# EasyEDA Pro project FOC_drive.epro, board PCB15
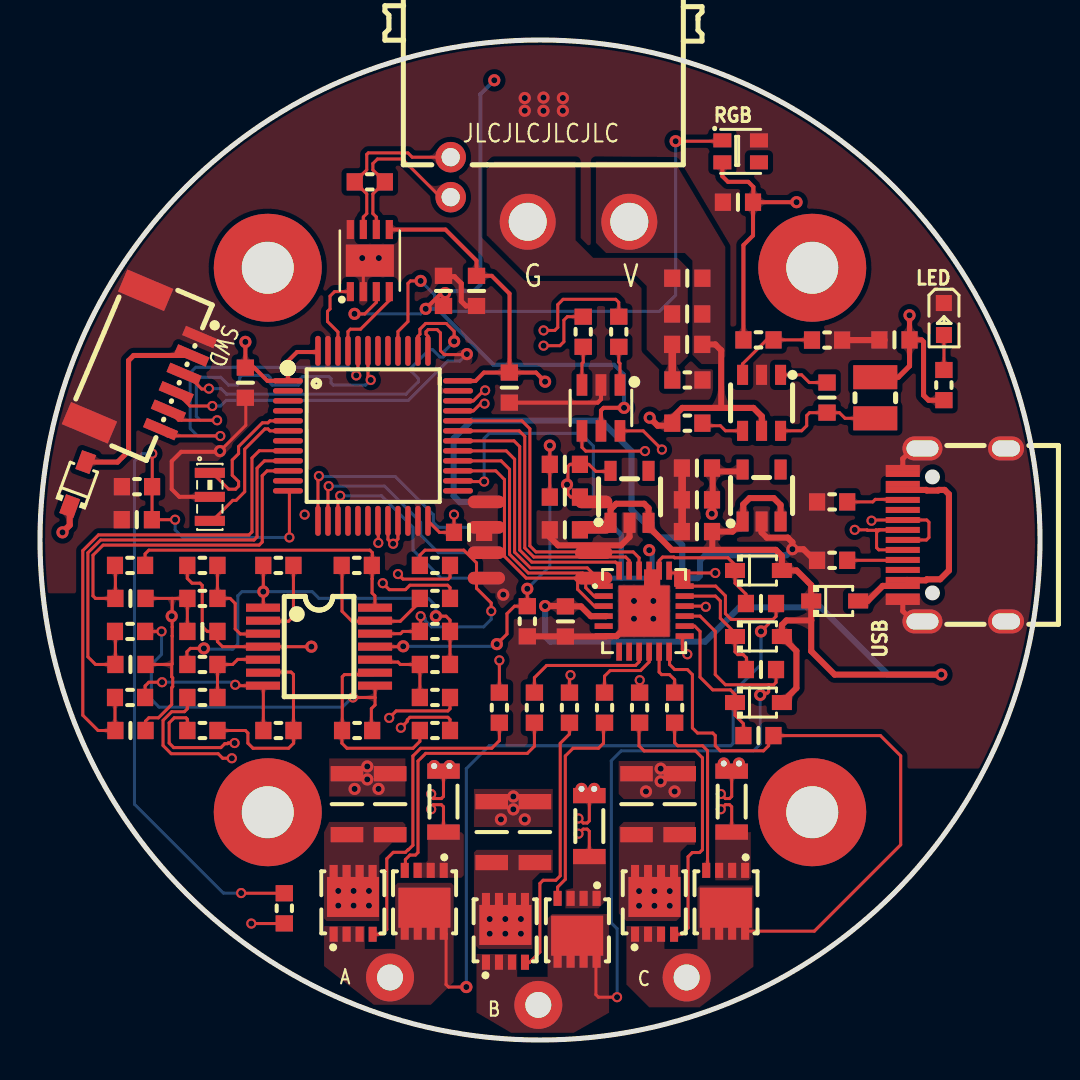
[diagram p1: board, top side]
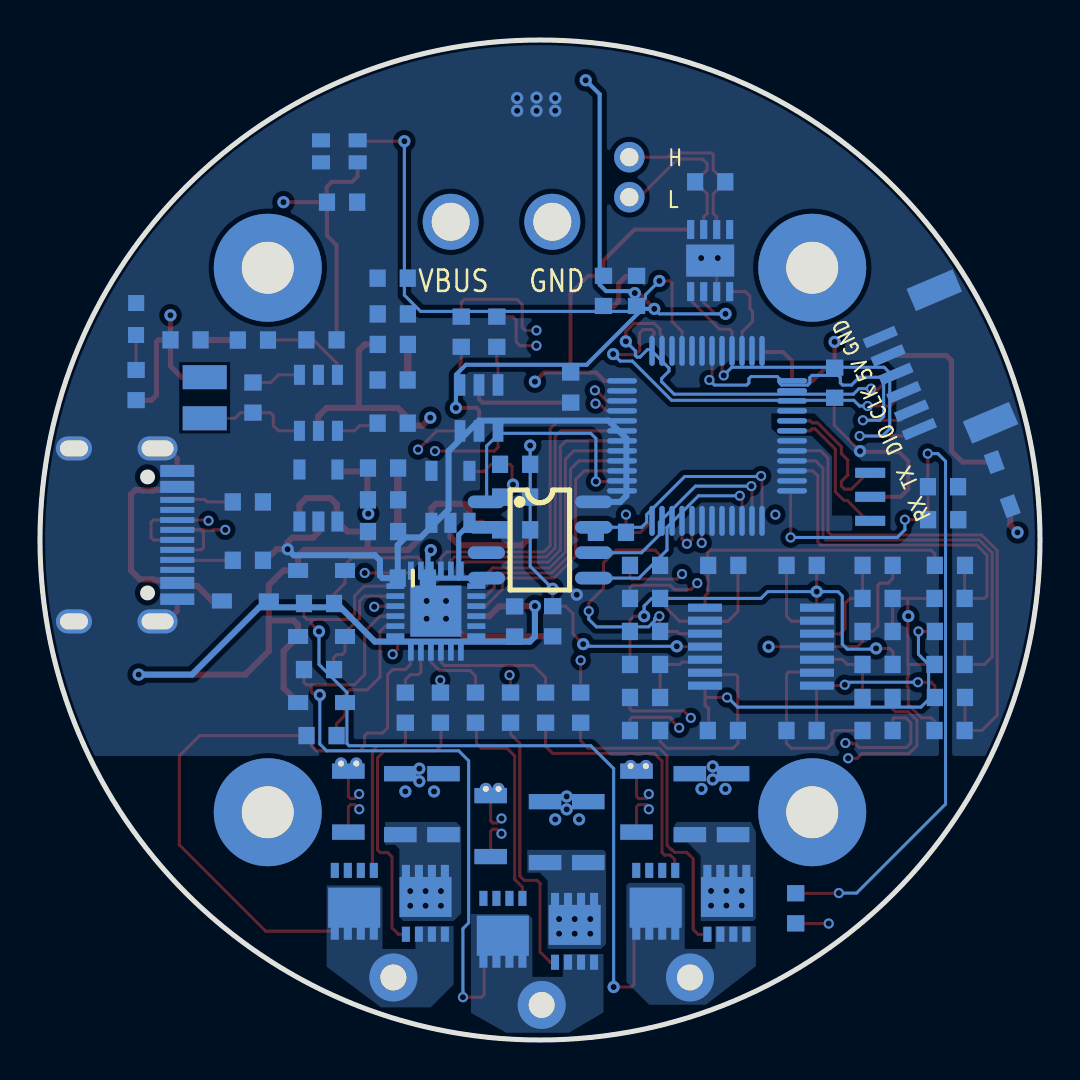
[diagram p2: board, bottom side, seen from below]

Outline 50 x 50 mm; copper layers: Top Layer, Inner1, Inner2, Bottom Layer. Coordinates in mm from the lower left corner of the outline.
Outline path: circle c25,25 r25
Stack: Top Layer 0.035mm / Dielectric1 1.51mm FR4 er 4.5 / Inner1 0.035mm / Dielectric2 0.48mm PP er 4.5 / Inner2 0.035mm / Dielectric3 0.48mm PP er 4.5 / Bottom Layer 0.035mm

## Design rules (mm)
net UART1_RX: UART
net UART1_TX: UART
net SWDIO: SWD
net SWCLK: SWD
net O_IN: OSC
net O_OUT: OSC
net CAN_TX: CAN_TR
net CAN_RX: CAN_TR
net USB_DM: USB
net USB_DP: USB
spacing copperThickness1oz (default): track to track 0.102, other pairs 0.152 to 0.3
spacing copperThickness2oz: track to track 0.203, other pairs 0.152 to 0.3
spacing Plane_innerPlane: track to track 0.102, other pairs 0.152 to 0.3
spacing Copper_copperRegion: track to track 0.102, other pairs 0.152 to 0.3
track width copperThickness1oz (default): min 0.127, default 0.254, max 2.54
track width copperThickness2oz: min 0.203, default 0.254, max 2.54
differential pair differentialPair (default): width min 0.127, default 0.254, max 2.54; gap min 0.152, default 0.152
net PGND uses Copper_copperRegion, Plane_innerPlane
net +5V uses Copper_copperRegion, Plane_innerPlane
net +5V_BUS uses Copper_copperRegion, Plane_innerPlane
net IA uses Copper_copperRegion, Plane_innerPlane
net IB uses Copper_copperRegion, Plane_innerPlane
net IC uses Copper_copperRegion, Plane_innerPlane
net $1N5545 uses Copper_copperRegion, Plane_innerPlane
net $1N5557 uses Copper_copperRegion, Plane_innerPlane
net AGND uses Copper_copperRegion, Plane_innerPlane
net $1N5552 uses Copper_copperRegion, Plane_innerPlane
net UART1_RX uses Copper_copperRegion, Plane_innerPlane
net UART1_TX uses Copper_copperRegion, Plane_innerPlane
net SWDIO uses Copper_copperRegion, Plane_innerPlane
net +1.65V uses Copper_copperRegion, Plane_innerPlane
net AVCC uses Copper_copperRegion, Plane_innerPlane
net IA+ uses Copper_copperRegion, Plane_innerPlane
net SWCLK uses Copper_copperRegion, Plane_innerPlane
net GND uses Copper_copperRegion, Plane_innerPlane
net $1N5625 uses Copper_copperRegion, Plane_innerPlane
net $1N5544 uses Copper_copperRegion, Plane_innerPlane
net O_IN uses Copper_copperRegion, Plane_innerPlane
net $1N5543 uses Copper_copperRegion, Plane_innerPlane
net O_OUT uses Copper_copperRegion, Plane_innerPlane
net +3.3V uses Copper_copperRegion, Plane_innerPlane
net $1N5644 uses Copper_copperRegion, Plane_innerPlane
net SCK uses Copper_copperRegion, Plane_innerPlane
net $1N5549 uses Copper_copperRegion, Plane_innerPlane
net $1N5554 uses Copper_copperRegion, Plane_innerPlane
net MOSI uses Copper_copperRegion, Plane_innerPlane
net CAN_TX uses Copper_copperRegion, Plane_innerPlane
net CANH uses Copper_copperRegion, Plane_innerPlane
net +12V uses Copper_copperRegion, Plane_innerPlane
net CANL uses Copper_copperRegion, Plane_innerPlane
net $1N5641 uses Copper_copperRegion, Plane_innerPlane
net CAN_RX uses Copper_copperRegion, Plane_innerPlane
net MA uses Copper_copperRegion, Plane_innerPlane
net IB+ uses Copper_copperRegion, Plane_innerPlane
net RGB uses Copper_copperRegion, Plane_innerPlane
net $1N15779 uses Copper_copperRegion, Plane_innerPlane
net $1N5555 uses Copper_copperRegion, Plane_innerPlane
net IC+ uses Copper_copperRegion, Plane_innerPlane
net GH_A uses Copper_copperRegion, Plane_innerPlane
net $1N5612 uses Copper_copperRegion, Plane_innerPlane
net GL_A uses Copper_copperRegion, Plane_innerPlane
net $1N5608 uses Copper_copperRegion, Plane_innerPlane
net MB uses Copper_copperRegion, Plane_innerPlane
net USB_DM uses Copper_copperRegion, Plane_innerPlane
net USB_DP uses Copper_copperRegion, Plane_innerPlane
net GH_B uses Copper_copperRegion, Plane_innerPlane
net $1N10416 uses Copper_copperRegion, Plane_innerPlane
net USB_DM_IN uses Copper_copperRegion, Plane_innerPlane
net $1N5614 uses Copper_copperRegion, Plane_innerPlane
net GL_B uses Copper_copperRegion, Plane_innerPlane
net $1N10412 uses Copper_copperRegion, Plane_innerPlane
net USB_DP_IN uses Copper_copperRegion, Plane_innerPlane
net $1N5617 uses Copper_copperRegion, Plane_innerPlane
net GH_C uses Copper_copperRegion, Plane_innerPlane
net VB1 uses Copper_copperRegion, Plane_innerPlane
net GL_C uses Copper_copperRegion, Plane_innerPlane
net $1N5619 uses Copper_copperRegion, Plane_innerPlane
net MC uses Copper_copperRegion, Plane_innerPlane
net $1N40669 uses Copper_copperRegion, Plane_innerPlane
net VB3 uses Copper_copperRegion, Plane_innerPlane
net VB2 uses Copper_copperRegion, Plane_innerPlane
net $1N5464 uses Copper_copperRegion, Plane_innerPlane
net $1N5465 uses Copper_copperRegion, Plane_innerPlane
net $1N5466 uses Copper_copperRegion, Plane_innerPlane
net $1N9655 uses Copper_copperRegion, Plane_innerPlane
net $1N9644 uses Copper_copperRegion, Plane_innerPlane
net VUSB uses Copper_copperRegion, Plane_innerPlane
net $1N5599 uses Copper_copperRegion, Plane_innerPlane
net MISO uses Copper_copperRegion, Plane_innerPlane
net CSN uses Copper_copperRegion, Plane_innerPlane
net LIN2 uses Copper_copperRegion, Plane_innerPlane
net LIN3 uses Copper_copperRegion, Plane_innerPlane
net LIN1 uses Copper_copperRegion, Plane_innerPlane
net HIN1 uses Copper_copperRegion, Plane_innerPlane
net HIN2 uses Copper_copperRegion, Plane_innerPlane
net HIN3 uses Copper_copperRegion, Plane_innerPlane
net $1N10397 uses Copper_copperRegion, Plane_innerPlane
net NTC uses Copper_copperRegion, Plane_innerPlane
pour e1451 uses Copper_copperRegion, copperRegion
pour e1444 uses Copper_copperRegion
pour e1449 uses Copper_copperRegion
pour e1453 uses Copper_copperRegion
pour e1455 uses Copper_copperRegion
pour e1457 uses Copper_copperRegion
pour e1459 uses Copper_copperRegion

## Placement (name value [footprint] x y rotation side)
C1  100nF  [C0603_S]  32.37 38.09 0 top
C2  100nF  [C0603_S]  32.37 36.3 0 top
C40  100nF  [C0603_S]  31.35 23.09 180 bottom
C41  10uF  [C0603_S]  26.27 20.94 90 top
C43  10uF  [C1206_SMALL]  15.35 11.79 270 top
C44  10uF  [C1206_SMALL]  17.51 11.79 270 top
C45  10uF  [C1206_SMALL]  22.59 10.39 270 top
C46  10uF  [C1206_SMALL]  24.75 10.39 270 top
C47  10uF  [C1206_SMALL]  29.83 11.79 270 top
C48  10uF  [C1206_SMALL]  31.99 11.79 270 top
C56  100nF  [C0603_S]  8.13 20.43 0 top
C57  1uF  [C0603_S_1]  4.51 15.47 180 top
C58  1uF  [C0603_S_1]  4.51 18.78 180 top
C59  1uF  [C0603_S_1]  4.51 22.08 180 top
C62  100nF  [C0603_S_3]  39.35 32.11 270 top
C63  100nF  [C0603_S]  32.86 25.42 0 top
C64  100nF  [C0603_S]  32.86 27.01 0 top
C65  100nF  [C0603_S]  32.86 28.6 0 top
C66  100nF  [C0603_S]  26.25 27.15 0 top
C67  100nF  [C0603_S]  26.25 25.51 0 top
C68  100nF  [C0603_S]  26.25 28.78 0 top
C69  1uF  [C0603S]  36.05 21.83 0 top
C70  1uF  [C0603S]  36.05 18.52 0 top
C71  1uF  [C0603S]  35.92 15.22 0 top
C76  100nF  [C0603_S]  20.17 37.45 270 top
C77  100nF  [C0603_S]  21.83 37.46 90 top
C78  100nF  [C0603_S]  34.91 41.89 0 top
C79  100nF  [C0603_S_3]  42.73 35.01 0 top
C80  100nF  [C0603_S]  32.37 34.78 0 top
C90  100nF  [C0603_S]  10.27 32.87 90 top
C91  100nF  [C0603_S]  21.44 25.38 180 top
C92  100nF  [C0603_S]  23.47 32.63 90 top
C100  1uF  [C0603_S]  4.85 26.02 0 top
CN1  WAFER-SH1.0-6PWB  [CONN-SMD_6P-P1.00_XUNPU_WAFER-SH1.0-6PWB]  5.44 33.51 247 top
D3  1N5819WS  [SOD-323_L1.8-W1.3-LS2.5-RD]  35.92 23.48 0 top
D4  1N5819WS  [SOD-323_L1.8-W1.3-LS2.5-RD]  35.92 20.17 0 top
D5  1N5819WS  [SOD-323_L1.8-W1.3-LS2.5-RD]  35.92 16.87 0 top
D7  1N5819WS  [SOD-323_L1.8-W1.3-LS2.5-RD]  1.89 27.79 70 top
D8  USBLC6-2SC6  [SOT-23-6_L2.9-W1.6-P0.95-LS2.8-BL]  28.05 31.6 180 top
D9  1N5819WS  [SOD-323_L1.8-W1.3-LS2.5-RD]  39.73 21.95 0 top
L1  4.7uH  [IND-SMD_L2.5-W2.0]  41.76 32.11 270 top
LED  XL-1608UBC-04  [LED0603-RD_BLUE]  45.19 36.05 270 top
NOREF  -  [Pad_e132]  27.07 12.55 0 top
NOREF#2  -  [Pad_e137]  11.39 38.61 0 top
NOREF#3  -  [Pad_e131]  34.95 13.82 0 top
NOREF#4  -  [Pad_e130]  34.19 13.82 0 top
NOREF#5  -  [Pad_e141]  24.92 1.75 0 top
NOREF#6  -  [Pad_e140]  17.5 3.13 0 top
NOREF#7  -  [Pad_e142]  32.33 3.13 0 top
NOREF#8  -  [Pad_e138]  38.61 11.39 0 top
NOREF#9  -  [Pad_e135]  20.47 13.7 0 top
NOREF#10  -  [Pad_e133]  27.71 12.55 0 top
NOREF#11  -  [Pad_e139]  38.61 38.61 0 top
NOREF#12  -  [Pad_e134]  19.71 13.7 0 top
NOREF#13  -  [Pad_e136]  11.39 11.39 0 top
Q1  WSD4070DN33  [PDFN3333-8_L3.1-W3.2-P0.65-LS3.4-BL]  15.66 6.82 0 top
Q2  WSD4070DN33  [PDFN3333-8_L3.1-W3.2-P0.65-LS3.4-BL]  23.27 5.42 0 top
Q3  WSD4070DN33  [PDFN3333-8_L3.1-W3.2-P0.65-LS3.4-BL]  30.73 6.82 0 top
Q4  WSD4070DN33  [PDFN3333-8_L3.1-W3.2-P0.65-LS3.4-BL]  19.21 6.95 180 top
Q5  WSD4070DN33  [PDFN3333-8_L3.1-W3.2-P0.65-LS3.4-BL]  26.85 5.55 180 top
Q6  WSD4070DN33  [PDFN3333-8_L3.1-W3.2-P0.65-LS3.4-BL]  34.28 6.95 180 top
R48  10kΩ  [R0603_S]  32.37 30.84 180 top
R54  2kΩ  [R0603_S]  8.12 15.47 0 top
R55  2kΩ  [R0603_S]  8.12 17.13 0 top
R56  2kΩ  [R0603_S]  19.75 15.47 180 top
R57  2kΩ  [R0603_S]  19.75 17.13 180 top
R59  2kΩ  [R0603_S]  19.75 23.73 180 top
R60  1kΩ  [R0603_S]  8.12 23.73 180 top
R61  1kΩ  [R0603_S]  8.12 22.08 0 top
R62  500Ω  [R0603_S]  11.92 23.73 180 top
R63  68kΩ  [R0603_S]  11.92 15.47 0 top
R64  68kΩ  [R0603_S]  15.86 15.47 180 top
R65  68kΩ  [R0603_S]  15.84 23.73 180 top
R66  68kΩ  [R0603_S]  8.12 18.78 0 top
R67  68kΩ  [R0603_S]  19.75 18.78 180 top
R68  68kΩ  [R0603_S]  19.75 20.43 180 top
R69  22Ω  [R0603_S]  4.5 17.13 180 top
R70  22Ω  [R0603_S]  4.5 20.43 180 top
R71  22Ω  [R0603_S]  4.5 23.73 180 top
R72  2kΩ  [R0603_S]  19.75 22.08 180 top
R73  62kΩ  [R0603_S]  35.92 35.01 0 top
R74  12kΩ  [R0603_S]  39.35 35 0 top
R75  120Ω  [R0603_S]  16.49 42.91 180 top
R77  22Ω  [R0603_SMALL]  28.94 35.41 270 top
R78  22Ω  [R0603_SMALL]  27.16 35.41 270 top
R79  5.1kΩ  [R0603_SMALL]  39.61 26.91 0 top
R80  5.1kΩ  [R0603_SMALL]  39.61 23.98 180 top
R81  4.7Ω  [R0603_S]  22.97 16.62 270 top
R82  4.7Ω  [R0603_S]  24.72 16.62 270 top
R83  4.7Ω  [R0603_S]  26.47 16.62 270 top
R84  4.7Ω  [R0603_S]  28.23 16.62 270 top
R85  4.7Ω  [R0603_S]  29.98 16.62 270 top
R86  4.7Ω  [R0603_S]  31.73 16.62 270 top
R87  0Ω  [R0603_S]  32.37 33 0 top
R88  0Ω  [R0603_S]  24.37 20.94 90 top
R89  10kΩ  [R0603_SMALL]  45.19 32.75 270 top
R99  KNTC0603/10KF3950  [R0603_SMALL]  12.22 6.59 270 top
R100  3.3kΩ  [R0603_SMALL]  4.85 27.67 0 top
RGB  WS2812B-2020  [LED-SMD_4P-L2.0-W2.0-TL_WS2812B-2020]  35.03 44.43 0 top
U1  XT30PW(2+2)-M.G.B  [CONN-TH_4P-XT30PW-M]  25 42.53 180 top
U5  XC6210B332MR  [SOT-23-5_L3.0-W1.7-P0.95-LS2.8-BR]  36.08 27.22 270 top
U6  RY8411  [SOT-23-6_L2.9-W1.6-P0.95-LS2.8-BR]  36.08 31.86 90 top
U7  LP5907QMFX-3.3Q1  [SOT-23-5_L3.0-W1.7-P0.95-LS2.8-BR]  29.48 27.16 270 top
U9  FD6288Q  [QFN-24_L4.0-W4.0-P0.50-BL-EP2.6]  30.21 21.44 270 top
U10  TJA1051TK/3/1J  [HVSON-8_L3.0-W3.0-P0.65-BL-EP]  16.49 38.97 0 top
U11  10mΩ  [R1206_SMALL]  20.17 11.92 270 top
U12  10mΩ  [R1206_SMALL]  27.47 10.7 270 top
U13  10mΩ  [R1206_SMALL]  34.58 11.92 270 top
U14  RS724XQ  [TSSOP-14_L5.0-W4.4-P0.65-LS6.4-BL]  13.95 19.67 270 top
U15  MT6816CT-STD  [SOP-8_L4.9-W3.9-P1.27-LS6.0-BL]  25 25 270 bottom
U18  STM32G431CBT6  [LQFP-48_L7.0-W7.0-P0.50-LS9.0-BL]  16.65 30.21 270 top
USB  TYPE-C-31-M-12  [USB-C_SMD-TYPE-C-31-M-12]  45.83 25.25 90 top
X2  8MHz  [OSC-SMD_3P-L3.2-W1.3-P1.20]  8.49 27.16 270 top

## Footprints (pads in the part's own frame, mm; a bottom-side part is the same pattern mirrored in y, then rotated)
C0603_S
  rect 0.806x0.864 hole 0.001: 1(-0.762,0) 2(0.745,0)
C0603_S_1
  rect 0.806x0.864 hole 0.001: 1(-0.762,0) 2(0.745,0)
C0603_S_3
  rect 0.806x0.864 hole 0.001: 1(-0.762,0) 2(0.745,0)
C0603S
  rect 0.806x0.864 hole 0.001: 1(-0.752,0) 2(0.752,0)
C1206_SMALL
  rect 0.762x1.625 hole 0.001: 1(-1.524,0) 2(1.524,0)
CONN-SMD_6P-P1.00_XUNPU_WAFER-SH1.0-6PWB
  rect 0.5x1.7 hole 0.001: 1(-2.5,1.7) 2(-1.5,1.7) 3(-0.5,1.7) 4(0.5,1.7) 5(1.5,1.7) 6(2.5,1.7)
  rect 1.2x2.5 hole 0.001: 7(3.6,-1.7) 8(-3.6,-1.7)
CONN-TH_4P-XT30PW-M
  round 2.8 hole 1.9: 1(-4.465,1.615) 2(0.615,1.615)
  round 1.524 hole 0.914: 3(4.465,0.385) 4(4.465,-1.615)
HVSON-8_L3.0-W3.0-P0.65-BL-EP
  rect 0.355x0.95 hole 0.001: 1(-0.975,-1.552) 2(-0.325,-1.552) 3(0.325,-1.552) 4(0.975,-1.552) 5(0.975,1.552) 6(0.325,1.552) 7(-0.325,1.552) 8(-0.975,1.552)
  rect 2.4x1.6 hole 0.001: 9(0,0)
IND-SMD_L2.5-W2.0
  rect 1.2x2.2 hole 0.001: 1(1.028,0) 2(-1.028,0)
LED0603-RD_BLUE
  rect 0.8x0.8 hole 0.001: 1(-0.799,-0.004) 2(0.799,0.004)
LED-SMD_4P-L2.0-W2.0-TL_WS2812B-2020
  rect 0.9x0.7 hole 0.001: 1(-0.915,0.55) 2(-0.915,-0.55) 3(0.915,-0.55) 4(0.915,0.55)
LQFP-48_L7.0-W7.0-P0.50-LS9.0-BL
  oval 0.27x1.5 hole 0.001: 1(-2.75,-4.25) 2(-2.25,-4.25) 3(-1.75,-4.25) 4(-1.25,-4.25) 5(-0.75,-4.25) 6(-0.25,-4.25) 7(0.25,-4.25) 8(0.75,-4.25) 9(1.25,-4.25) 10(1.75,-4.25) 11(2.25,-4.25) 12(2.75,-4.25) 25(2.75,4.25) 26(2.25,4.25) 27(1.75,4.25) 28(1.25,4.25) 29(0.75,4.25) 30(0.25,4.25) 31(-0.25,4.25) 32(-0.75,4.25) 33(-1.25,4.25) 34(-1.75,4.25) 35(-2.25,4.25) 36(-2.75,4.25)
  oval 1.5x0.27 hole 0.001: 13(4.25,-2.75) 14(4.25,-2.25) 15(4.25,-1.75) 16(4.25,-1.25) 17(4.25,-0.75) 18(4.25,-0.25) 19(4.25,0.25) 20(4.25,0.75) 21(4.25,1.25) 22(4.25,1.75) 23(4.25,2.25) 24(4.25,2.75) 37(-4.25,2.75) 38(-4.25,2.25) 39(-4.25,1.75) 40(-4.25,1.25) 41(-4.25,0.75) 42(-4.25,0.25) 43(-4.25,-0.25) 44(-4.25,-0.75) 45(-4.25,-1.25) 46(-4.25,-1.75) 47(-4.25,-2.25) 48(-4.25,-2.75)
OSC-SMD_3P-L3.2-W1.3-P1.20
  rect 0.5x1.5 hole 0.001: 1(-1.2,0) 2(0,0) 3(1.2,0)
Pad_e130
  round 0.61 hole 0.305: 1(0,0)
Pad_e131
  round 0.61 hole 0.305: 1(0,0)
Pad_e132
  round 0.61 hole 0.305: 1(0,0)
Pad_e133
  round 0.61 hole 0.305: 1(0,0)
Pad_e134
  round 0.61 hole 0.305: 1(0,0)
Pad_e135
  round 0.61 hole 0.305: 1(0,0)
Pad_e136
  round 5.4 hole 2.6: 1(0,0)
Pad_e137
  round 5.4 hole 2.6: 1(0,0)
Pad_e138
  round 5.4 hole 2.6: 1(0,0)
Pad_e139
  round 5.4 hole 2.6: 1(0,0)
Pad_e140
  round 2.4 hole 1.3: 1(0,0)
Pad_e141
  round 2.4 hole 1.3: 1(0,0)
Pad_e142
  round 2.4 hole 1.3: 1(0,0)
PDFN3333-8_L3.1-W3.2-P0.65-LS3.4-BL
  rect 0.4x0.75 hole 0.001: 1(-0.975,-1.534) 2(-0.325,-1.534) 3(0.325,-1.534) 4(0.975,-1.534)
  rect 0.4x0.8 hole 0.001: 5(0.975,1.534) 6(0.325,1.534) 7(-0.325,1.534) 8(-0.975,1.534)
  rect 2.6x2 hole 0.001: 9(-0.004,0.333)
QFN-24_L4.0-W4.0-P0.50-BL-EP2.6
  rect 0.28x0.9 hole 0.001: 1(-1.25,-2.025) 2(-0.75,-2.025) 3(-0.25,-2.025) 4(0.25,-2.025) 5(0.75,-2.025) 6(1.25,-2.025) 13(1.25,2.025) 14(0.75,2.025) 15(0.25,2.025) 16(-0.25,2.025) 17(-0.75,2.025) 18(-1.25,2.025)
  rect 0.9x0.28 hole 0.001: 7(2.025,-1.25) 8(2.025,-0.75) 9(2.025,-0.25) 10(2.025,0.25) 11(2.025,0.75) 12(2.025,1.25) 19(-2.025,1.25) 20(-2.025,0.75) 21(-2.025,0.25) 22(-2.025,-0.25) 23(-2.025,-0.75) 24(-2.025,-1.25)
  rect 2.55x2.55 hole 0.001: 25(0,0)
R0603_S
  rect 0.806x0.864 hole 0.001: 1(-0.752,0) 2(0.754,0)
R0603_SMALL
  rect 0.806x0.864 hole 0.001: 1(-0.753,0) 2(0.753,0)
R1206_SMALL
  rect 0.762x1.625 hole 0.001: 1(-1.524,0) 2(1.524,0)
SOD-323_L1.8-W1.3-LS2.5-RD
  rect 1x0.75 hole 0.001: 1(-1.173,0) 2(1.173,0)
SOP-8_L4.9-W3.9-P1.27-LS6.0-BL
  oval 0.63x1.865 hole 0.001: 1(-1.905,-2.683) 2(-0.635,-2.683) 3(0.635,-2.683) 4(1.905,-2.683) 5(1.905,2.683) 6(0.635,2.683) 7(-0.635,2.683) 8(-1.905,2.683)
SOT-23-5_L3.0-W1.7-P0.95-LS2.8-BR
  rect 1x0.6 hole 0.001: 1(1.3,-0.95) 2(1.3,0) 3(1.3,0.95) 4(-1.3,0.95) 5(-1.3,-0.95)
SOT-23-6_L2.9-W1.6-P0.95-LS2.8-BL
  rect 0.532x1.072 hole 0.001: 1(-0.95,-1.149) 2(0,-1.149) 3(0.95,-1.149) 4(0.95,1.149) 5(0,1.149) 6(-0.95,1.149)
SOT-23-6_L2.9-W1.6-P0.95-LS2.8-BR
  rect 1x0.55 hole 0.001: 1(1.4,-0.95) 2(1.4,0) 3(1.4,0.95) 4(-1.4,0.95) 5(-1.4,0) 6(-1.4,-0.95)
TSSOP-14_L5.0-W4.4-P0.65-LS6.4-BL
  rect 0.4x1.7 hole 0.001: 1(-1.95,-2.8) 2(-1.3,-2.8) 3(-0.65,-2.8) 4(0,-2.8) 5(0.65,-2.8) 6(1.3,-2.8) 7(1.95,-2.8) 8(1.95,2.8) 9(1.3,2.8) 10(0.65,2.8) 11(0,2.8) 12(-0.65,2.8) 13(-1.3,2.8) 14(-1.95,2.8)
USB-C_SMD-TYPE-C-31-M-12
  oval 1.2x2 hole 0.8x1.6: 0(-4.325,1.706) 1(4.325,1.706)
  oval 1.2x1.8 hole 0.8x1.4: 2(4.325,-2.474) 3(-4.325,-2.474)
  rect 0.3x1.7 hole 0.001: A1(-3.35,2.69) A4(-2.55,2.69) A5(-1.25,2.69) A6(-0.25,2.69) A7(0.25,2.69) A8(1.25,2.69) A9(2.55,2.69) A12(3.35,2.69) B1(3.05,2.69) B4(2.25,2.69) B5(1.75,2.69) B6(0.746,2.69) B7(-0.75,2.69) B8(-1.75,2.69) B9(-2.25,2.69) B12(-3.08,2.69)

## Nets
As in the schematic, except:
+5V: C41.2 C63.2 C67.2 C76.2 C78.2 C79.2 D3.2 D4.2 D5.2 D7.1 D8.5 D9.1 L1.2 R73.1 R89.2 RGB.2 U5.1 U5.3 U7.1 U7.3 U9.4 U10.3
GND: C40.1 C41.1 C63.1 C64.1 C65.1 C67.1 C76.1 C77.1 C78.1 C79.1 C90.1 C91.1 C92.1 C100.1 CN1.1 CN1.7 CN1.8 D8.2 LED.1 R74.2 R79.1 R80.2 R87.2 R88.1 R100.1 RGB.4 U5.2 U6.2 U7.2 U9.6 U9.25 U10.2 U10.8 U10.9 U15.8 U18.23 U18.35 U18.47 USB.0 USB.1 USB.2 USB.3 USB.A1 USB.A12 USB.B1 USB.B12 X2.2
PGND: C1.1 C2.1 C43.1 C44.1 C45.1 C46.1 C47.1 C48.1 C80.1 NOREF.1 NOREF#3.1 NOREF#4.1 NOREF#9.1 NOREF#10.1 NOREF#12.1 R54.1 R56.1 R72.1 R87.1 U1.2 U11.1 U12.1 U13.1
MA: C69.2 NOREF#6.1 Q1.1 Q1.2 Q1.3 Q4.5 Q4.6 Q4.7 Q4.8 Q4.9 U9.18
MB: C70.2 NOREF#5.1 Q2.1 Q2.2 Q2.3 Q5.5 Q5.6 Q5.7 Q5.8 Q5.9 U9.15
MC: C71.2 NOREF#7.1 Q3.1 Q3.2 Q3.3 Q6.5 Q6.6 Q6.7 Q6.8 Q6.9 U9.12
RGB: RGB.1 U18.40
USB_DM_IN: D8.4 USB.A7 USB.B7
USB_DP_IN: D8.6 USB.A6 USB.B6
VUSB: D9.2 USB.A4 USB.A9 USB.B4 USB.B9
$1N5599: LED.2 R89.1
$1N9644: R79.2 USB.B5
$1N9655: R80.1 USB.A5

Pads without a net: NOREF#2 1; NOREF#8 1; NOREF#11 1; NOREF#13 1; RGB 3; U5 4; U7 4; U9 5 7 8 21; U15 3; U18 2 3 4 7 11 17 18 22 25 39 41 42; USB A8 B8

## Via types
v1: diameter 0.508, hole 0.305, Top Layer to Bottom Layer, 52 vias
v2: diameter 0.61, hole 0.305, Top Layer to Bottom Layer, 77 vias

## Routing (per net, layer and track width the routed paths; a pad name or vN(x,y) marks a point on that pad's centre or on a via; arc(x,y) is an arc through that point)
+1.65V: length 21.7
  Top Layer w0.152: R62.2 v2(11.16,22.42) 11.16,21.63 U14.1 ; R66.1 7.35,18.8 7.35,19.41 7.52,19.58 v2(8.2,19.58) ; R67.1 R68.1 20.5,20.99 20.3,21.19 v2(19.79,21.19)
  Bottom Layer w0.152: 8.24,19.54 9.63,19.54 9.89,19.79 9.89,22.21 10.1,22.42 v2(11.16,22.42) 13.61,22.42 13.95,22.08 19.41,22.08 19.79,21.7 v2(19.79,21.19)
+3.3V: length 69.7
  Top Layer w0.152: v1(20.7,26.27) C91.2 19.97,25.38 U18.24 ; v1(10.56,5.82) 12.21,5.82 R99.2
  Top Layer w0.203: v2(10.27,34.91) C90.2 10.71,33.62 11.37,32.96 U18.1 12.4,33.94 12.85,34.4 13.84,34.4 U18.48 ; 23.47,33.37 22.2,33.37 21.77,32.95 20.76,32.95 ; 23.47,33.37 24.8,33.37 v2(25.25,32.92) ; 23.47,33.37 23.48,33.38 23.48,37.32 22.59,38.21 C77.2 21.83,38.97 20.27,40.52 U10.5
  Top Layer w0.305: 35.13,28.52 35.03,28.43 33.64,28.43 33.64,26.36 v2(33.59,26.31)
  Inner1 w0.152: v1(10.56,5.82) 4.47,11.92 4.47,23.6 5.23,24.36 12.6,24.36 13.23,25 v1(13.23,26.27)
  Bottom Layer w0.254: U15.2 28.68,25.64 29.06,25.25 29.06,23.09 ; 29.06,23.09 C40.2 30.61,24.35 v2(30.46,24.49) ; 29.06,23.09 U15.4
+5V: length 122.3
  Top Layer w0.152: v2(15.73,36.31) 15.73,36.3 16.24,36.3 16.82,36.88 U10.3
  Top Layer w0.203: D8.5 28.05,31.48 28.18,31.61 v2(29.2,31.61) ; v2(20.26,37.35) 20.08,37.35 v2(19.28,36.56) ; R73.1 35.17,39.74 35.65,40.22 35.65,41.89 ; 35.65,41.89 35.67,41.91 35.67,42.65 35.41,42.91 34.4,42.91 34.12,43.19 RGB.2 ; 35.65,41.89 v2(37.83,41.89)
  Top Layer w0.254: 43.73,35.01 44.08,35.01 44.18,34.91 44.18,32.24 44.43,31.98 45.18,31.98 R89.2 ; 43.73,35.01 43.48,35.26 v2(43.48,36.24) ; 43.73,35.01 C79.2 43.48,33.7 42.92,33.14 L1.2
  Top Layer w0.305: 28.3,21.19 28.3,21.19 27.54,21.19 27.05,21.68 C41.2 26.25,21.7 v2(25.25,21.7) ; 33.61,24.51 33.61,25.41 C63.2 34.63,25.42 35.16,25.96 35.16,26.78 35.48,27.1 36.68,27.1 37.03,26.75 U5.3 ; 33.61,24.51 31.59,24.51 30.43,25.67 U7.3 30.43,26.59 30.21,26.81 28.81,26.81 28.53,26.53 U7.1 27.89,25.86 27.54,25.51 C67.2 ; 33.61,24.51 36.79,24.51 37.09,24.2 D3.2 37.83,23.48 38.56,22.74 D9.1 38.56,20.98 ; 38.56,20.98 37.32,20.98 37.09,20.75 D4.2 37.82,19.45 37.82,17.6 D5.2 ; 38.56,20.98 38.56,19.44 39.73,18.27 v2(45.07,18.27) ; v2(1.12,25.38) 1.49,25.74 D7.1
  Bottom Layer w0.152: v2(19.28,36.56) 19.03,36.31 v2(15.73,36.31)
  Bottom Layer w0.203: v2(19.28,36.56) 19.87,36.56 22.67,33.76 28.71,33.76 29.2,33.26 v2(29.2,31.61) ; v2(22.71,47.99) 22.02,47.29 22.02,37.76 21.7,37.45 20.36,37.45 v2(20.26,37.35)
  Bottom Layer w0.305: v2(25.25,21.7) 25.25,20.17 25.51,19.92 33.25,19.92 34.97,21.63 39.03,21.63 42.4,18.27 v2(45.07,18.27)
+5V_BUS: length 10.2
  Top Layer w0.254: CN1.2 4.68,34.23 4.43,33.97 4.43,29.44 3.88,28.9 D7.2
+12V: length 11.1
  Top Layer w0.305: 34.06,31.6 34.06,34.48 33.76,34.78 C80.2 ; 34.06,31.6 32.11,31.6 31.61,31.11 31.61,30.72 30.88,30.72 v2(30.48,31.11) ; 34.06,31.6 35.67,31.6 36.09,31.18 36.09,30.54
  vias: v2(14.91,7.45) v2(14.91,6.72) v2(15.68,7.45) v2(15.68,6.72) v2(16.45,7.45) v2(16.45,6.72) v2(22.49,6.05) v2(22.49,5.31) v2(23.27,6.05) v2(23.27,5.31) v2(24.05,6.05) v2(24.05,5.31) v2(29.95,7.45) v2(29.95,6.71) v2(30.72,7.45) v2(30.72,6.71) v2(31.49,7.45) v2(31.49,6.71)
AGND: length 54.2
  Top Layer w0.152: 6.61,22.08 6.61,20.65 6.61,20.65 6.61,20.21 6.61,20.2 6.61,18.8 6.59,18.78 ; 6.61,22.08 C59.1 ; 6.61,22.08 R61.1 C56.1 ; v1(16.91,24.85) 16.91,25.94 U18.19 ; v2(18.16,19.68) 18.14,19.67 U14.11 ; 6.59,18.78 6.59,18.16 6.64,18.11 6.64,17.67 6.59,17.62 6.59,16.77 5.92,16.11 5.44,16.11 5.28,15.94 C57.1 ; 6.59,18.78 C58.1 ; C66.1 C68.1 25.49,29.72 ; v2(22.84,19.79) 23.35,20.3 23.35,21.32 23.72,21.69 R88.2 v2(24.37,22.56)
  Inner1 w0.152: v1(16.91,24.85) 16.51,24.85 16.41,24.75 16.41,20.3 17.02,19.68 v2(18.16,19.68) 17.25,18.78 12.81,18.78 12.43,19.16 12.43,19.92 11.89,20.45 8.46,20.45 7.73,21.19 v2(6.59,21.19)
  Bottom Layer w0.152: v2(18.16,19.68) 22.73,19.68 v2(22.84,19.79) ; v2(25.49,29.72) 25.49,23.69 v2(24.37,22.56)
AVCC: length 42
  Top Layer w0.152: v2(13.57,19.67) U14.4 9.12,19.67 8.87,19.92 C56.2 8.36,20.43 8.11,20.68 8.11,22.73 8,22.84 7.6,22.84 7.36,23.08 R60.2 ; U18.21 17.9,25.05 v1(17.66,24.81) 17.61,24.81 17.4,25.03 U18.20 ; U7.5 28.5,28.43 27.79,28.43 27.44,28.78 C68.2 26.5,28.78 26.4,28.67 26.4,27.81 v2(26.35,27.77) 26.4,27.72 26.4,27.29 26.54,27.15 C66.2
  Inner1 w0.152: 18.02,26.43 17.98,26.4 15.98,26.4 15.86,26.27 15.86,25.13 15.6,24.87 15.22,24.87 14.97,24.62 14.97,21.7 13.57,20.3 v2(13.57,19.67) ; 18.02,26.43 18.02,28.68 19.79,30.46 25.51,30.46 26.35,29.62 v2(26.35,27.77) ; 18.02,26.43 18.02,26.02 17.66,25.66 v1(17.66,24.81)
GND: length 71
  Top Layer w0.152: v2(9,29.44) 10.29,30.74 10.29,32.09 C90.1 ; v2(16.11,39.1) 16.17,39.04 16.17,37.54
  Top Layer w0.203: X2.2 6.97,27.16 6.59,27.54 6.59,28.94 7.06,29.41 8.96,29.41 v2(9,29.44) ; D8.2 28.05,32.04 27.88,31.87 C92.1
  Top Layer w0.254: C77.1 21.3,36.7 21.06,36.94 21.06,37.83 20.72,38.17 20.3,38.17 ; USB.A12 43.14,29.06 43.65,29.58 USB.1 ; USB.0 43.65,20.93 43.14,21.44 USB.A1
  Top Layer w0.305: 28.3,20.19 28.83,20.19 v2(29.7,21.06) ; R88.1 26.26,20.18 C41.1 28.28,20.17 ; U5.2 36.08,25.38 36.34,25.12 37.39,25.12 37.62,24.89 v2(37.62,24.54) 38.17,24.54 38.72,23.98 ; U7.2 29.48,25.16 29.05,24.73 25.9,24.73 25.49,25.14 25.49,25.61 25.47,25.64 ; 40.36,35 42.21,35 42.22,35.01
  Top Layer w0.381: 32.11,25.57 32.11,28.43
  Bottom Layer w0.305: v2(37.62,24.54) 37.32,24.24 33.25,24.24 33,23.98 33,23.22 32.87,23.09 C40.1 32.11,24.75 31.73,25.13 30.97,25.13 29.57,26.52 29.57,29.44 28.05,30.97 21.57,30.97 20.68,30.08 20.68,27.21 20.99,26.91 U15.8
  vias: v2(16.94,39.1) v2(23.16,22.27) v2(24.24,47.1) v2(24.24,46.46) v2(25.17,47.12) v2(25.17,46.46) v2(26.14,47.1) v2(26.14,46.46) v2(29.7,21.95) v2(30.67,21.95) v2(30.67,21.06)
PGND: length 78.3
  Top Layer w0.152: v1(26.93,11.08) 26.93,11.08 27.16,10.85 27.36,10.85 27.47,10.96 27.47,12.18 ; R56.1 20.5,16.03 20.39,16.14 18.5,16.14 18.36,16 18.36,15.93 v1(18.04,15.61) ; v1(19.56,12.3) 19.56,12.18 19.67,12.07 20.07,12.07 20.17,12.18 20.17,13.4 ; 34.04,12.3 v1(34.04,12.3) 34.27,12.07 34.48,12.07 34.58,12.18 34.58,13.4 ; R54.1 7.37,16.04 7.3,16.11 6.71,16.11 6.46,15.86 6.46,14.85 6.69,14.62 9.04,14.62 9.24,14.81 9.37,14.81 9.41,14.85 v1(9.73,14.85) ; R72.1 20.5,22.62 20.38,22.74 18.5,22.74 18.27,22.52 17.46,22.52 v1(17.14,22.84)
  Top Layer w0.381: R87.1 31.61,34.77 C80.1
  Inner1 w0.152: v1(19.56,12.3) 18.98,12.3 18.75,12.07 17.2,12.07 17.15,12.02 15.51,12.02 15.2,12.33 15.2,14.1 14.59,14.71 11.96,14.71 11.86,14.82 11.86,15.22 11.75,15.33 11.2,15.33 11.09,15.22 11.09,14.82 10.99,14.71 10.52,14.71 10.43,14.62 10.27,14.62 10.04,14.85 v1(9.73,14.85) ; v1(26.93,11.08) 26.34,11.08 26.11,10.85 25.96,10.85 25.85,10.96 25.85,14.62 25.67,14.8 23.11,14.8 23.01,14.91 23.01,15.11 22.9,15.22 22.35,15.22 22.24,15.11 22.24,14.91 22.14,14.8 21.59,14.8 21.48,14.91 21.48,15.11 21.37,15.22 20.83,15.22 20.72,15.11 20.72,14.91 20.61,14.8 20.07,14.8 19.96,14.91 19.96,15.11 19.85,15.22 19.3,15.22 19.2,15.11 19.2,14.91 19.09,14.8 18.26,14.8 18.04,15.02 v1(18.04,15.61) ; 34.04,12.3 33.45,12.3 33.22,12.07 32.95,12.07 32.46,11.58 28.85,11.58 28.56,11.88 28.56,14.46 25.89,17.13 22.27,17.13 22.08,17.32 22.08,23.35 20.97,24.45 18.1,24.45 17.67,24.02 17.55,24.02 17.14,23.61 v1(17.14,22.84)
  vias: v2(15.73,12.55) v2(16.36,13.68) v2(16.36,13.03) v2(16.93,12.55) v2(23.05,11.03) v2(23.67,12.18) v2(23.67,11.53) v2(24.24,11.03) v2(30.3,12.43) v2(31.03,13.57) v2(31.03,12.94) v2(31.73,12.43)
CAN_RX: length 4.1
  Top Layer w0.152: U10.4 17.47,36.98 16.03,35.54 15.52,35.54 15.4,35.42 U18.45
CAN_TX: length 4.1
  Top Layer w0.152: U18.46 14.9,35.4 14.37,35.92 14.37,36.43 14.5,36.56 14.5,37.19 14.73,37.42 U10.1
CANH: length 8.6
  Top Layer w0.152: U10.7 16.17,41.15 16.34,41.32 16.34,42.31 R75.2 16.34,43.51 16.34,44.28 16.41,44.36 18.4,44.36 18.61,44.14 U1.4
CANL: length 8.6
  Top Layer w0.152: U1.3 20.03,42.14 18.12,44.05 16.87,44.05 16.64,43.82 16.64,43.51 R75.1 16.64,42.31 16.64,41.32 16.82,41.15 U10.6
CSN: length 12.1
  Top Layer w0.152: v1(22.21,27.92) 20.93,27.92 U18.26
  Bottom Layer w0.152: v1(22.21,27.92) 22.21,30.08 22.46,30.33 27.03,30.33 27.67,29.7 27.67,26.92 U15.1
GH_A: length 12.3
  Top Layer w0.152: 32.11,20.19 32.11,19.54 v1(32.37,19.28) ; v1(22.97,18.98) R81.1
  Inner2 w0.152: v1(22.97,18.98) 32.27,18.98 32.37,19.08 v1(32.37,19.28)
GH_B: length 11.7
  Top Layer w0.152: R83.1 26.47,18.19 v1(26.52,18.24) ; 33.25,21.69 32.11,21.69
  Inner2 w0.152: v1(26.52,18.24) 27,18.72 32.94,18.72 33.29,19.06 v1(33.29,21.66)
GH_C: length 11.6
  Top Layer w0.152: 31.46,23.35 v1(33.76,23.35) ; v1(29.99,17.99) 29.98,17.98 R85.1
  Inner2 w0.152: v1(33.76,23.35) 33.76,21.94 33.82,21.88 33.82,21.44 33.76,21.38 33.76,18.9 32.85,17.99 v1(29.99,17.99)
GL_A: length 6.9
  Top Layer w0.152: R82.1 24.72,18.12 25.33,18.73 29.78,18.73 29.96,18.91 29.96,19.54
GL_B: length 4
  Top Layer w0.152: R84.1 28.23,18.19 28.5,18.47 30.03,18.47 30.46,18.9 30.46,19.54
GL_C: length 2.7
  Top Layer w0.152: 30.96,19.54 30.96,18.4 31.08,18.27 31.48,18.27 31.73,18.02 R86.1
HIN1: length 14
  Top Layer w0.152: U18.30 23.7,29.96 23.98,29.67 23.98,24.5 24.59,23.89 28.77,23.89 28.96,23.71 28.96,23.35
HIN2: length 15.1
  Top Layer w0.152: 29.46,23.35 29.46,23.97 29.28,24.15 24.69,24.15 24.24,24.6 24.24,30.18 23.96,30.46 U18.31
HIN3: length 16.1
  Top Layer w0.152: 29.96,23.35 29.95,23.36 29.95,24.11 29.66,24.4 24.8,24.4 24.49,24.71 24.49,30.56 24.1,30.96 U18.32
IA: length 26.3
  Top Layer w0.152: U18.8 12.39,29.47 10.97,29.47 10.6,29.1 10.6,25.41 10.45,25.25 2.92,25.25 2.14,24.47 2.14,16.24 2.9,15.47 C57.2 3.75,15.49 R69.2
IA+: length 21.3
  Top Layer w0.152: v1(19.56,11.54) 19.56,11.66 19.67,11.77 20.07,11.77 20.17,11.66 20.17,10.44 ; R55.1 7.37,16.56 7.22,16.42 6.59,16.42 6.15,15.98 6.15,14.72 6.56,14.32 8.91,14.32 9.13,14.09 v1(9.59,14.09)
  Inner1 w0.152: v1(9.59,14.09) 9.95,14.09 10.18,14.32 10.55,14.32 10.65,14.41 14.34,14.41 14.89,13.86 14.89,12.21 15.38,11.72 17.27,11.72 17.32,11.77 18.75,11.77 18.98,11.54 v1(19.56,11.54)
IB: length 22.3
  Top Layer w0.152: R70.2 3.77,20.41 C58.2 2.78,18.78 2.39,19.16 2.39,24.36 3.03,25 10.7,25 10.85,25.15 10.85,28.59 11.22,28.96 U18.9
IB+: length 20.4
  Top Layer w0.152: 27.47,9.22 27.47,10.44 27.36,10.54 27.16,10.54 26.93,10.32 v1(26.93,10.32) ; R57.1 20.5,16.56 20.39,16.45 17.81,16.45 v1(17.46,16.11)
  Inner1 w0.152: v1(26.93,10.32) 26.34,10.32 26.11,10.54 25.83,10.54 25.55,10.83 25.55,14.33 25.38,14.5 17.71,14.5 17.46,14.75 v1(17.46,16.11)
IC: length 18.3
  Top Layer w0.152: U18.10 11.35,28.46 11.11,28.21 11.11,24.9 10.96,24.75 3.16,24.75 2.65,24.24 2.65,22.21 2.78,22.08 C59.2 3.77,23.71 R71.2
IC+: length 34.8
  Top Layer w0.152: v1(17.9,23.3) 18.15,23.04 20.41,23.04 20.5,23.13 R59.1 ; 34.58,10.44 34.58,11.66 34.48,11.77 34.27,11.77 34.04,11.54 v1(34.04,11.54)
  Inner1 w0.152: v1(17.9,23.3) 17.9,23.82 18.23,24.15 20.85,24.15 21.77,23.22 21.77,19.82 21.67,19.71 21.34,19.71 21.24,19.61 21.24,19.06 21.34,18.95 21.67,18.95 21.77,18.84 21.77,18.3 21.67,18.19 21.3,18.19 21.19,18.08 21.19,17.54 21.3,17.43 21.67,17.43 21.77,17.32 21.77,16.92 21.88,16.82 25.76,16.82 28.25,14.33 28.25,11.46 28.43,11.28 32.58,11.28 33.07,11.77 33.22,11.77 33.45,11.54 v1(34.04,11.54)
LIN1: length 12.7
  Top Layer w0.152: 28.3,21.69 27.72,21.69 26.88,22.53 26.88,22.94 26.73,23.09 24.31,23.09 23.22,24.18 23.22,28.02 22.79,28.46 U18.27
LIN2: length 13
  Top Layer w0.152: U18.28 23.06,28.96 23.48,28.54 23.48,24.29 24.41,23.35 27.13,23.35 27.29,23.2 27.29,22.61 27.71,22.19 28.3,22.19
LIN3: length 13.2
  Top Layer w0.152: U18.29 23.31,29.46 23.73,29.04 23.73,24.39 24.52,23.6 27.37,23.6 27.65,23.32 27.65,22.73 27.67,22.71 28.16,22.71 U9.1
MA: length 42.1
  Top Layer w0.152: C69.2 36.8,21.18 36.65,21.03 36.43,21.03 ; Q4.8 20.3,5.3 20.3,2.78 20.43,2.65 v2(21.32,2.65) ; 32.11,22.69 33.78,22.69 34.27,22.21 34.27,21.32 34.56,21.03 36.43,21.03 ; v2(36.05,20.43) 36.43,20.81 36.43,21.03
  Bottom Layer w0.152: v2(36.05,20.43) 36.05,18.78 34.65,17.38 34.65,14.82 34.54,14.71 22.46,14.71 21.32,13.57 v2(21.32,2.65)
MB: length 34
  Top Layer w0.152: 32.11,21.19 33,21.19 33.76,20.43 33.76,18.27 34.27,17.76 36.43,17.76 ; Q5.8 27.79,3.98 27.79,2.27 27.92,2.14 v1(28.85,2.14) ; 36.43,17.76 36.43,17.41 36.37,17.34 36.1,17.34 v2(36.01,17.25) ; 36.43,17.76 36.68,17.76 36.8,17.88 C70.2
  Bottom Layer w0.152: v2(36.01,17.25) 36.01,14.8 35.67,14.46 29.06,14.46 28.57,13.96 28.57,5.86 28.85,5.57 v1(28.85,2.14)
MC: length 31
  Top Layer w0.152: 31.46,19.54 31.48,19.52 31.48,18.78 31.73,18.52 32.37,18.52 32.62,18.27 32.62,15.6 32.87,15.35 33.64,15.35 33.76,15.22 33.76,14.71 34.02,14.46 36.18,14.46 36.43,14.71 36.43,15.22 36.43,15.22 42.02,15.22 43.03,14.2 43.03,9.76 38.72,5.44 35.29,5.44 Q6.8
MISO: length 11.4
  Top Layer w0.152: v1(14.43,27.69) 14.4,27.66 U18.14
  Bottom Layer w0.152: U15.6 19.92,24.36 19.03,25.25 19.03,25.89 17.23,27.69 v1(14.43,27.69)
MOSI: length 11
  Top Layer w0.152: v1(15.01,27.21) 14.9,27.1 U18.15
  Bottom Layer w0.152: v1(15.01,27.21) 17.07,27.21 18.65,25.64 18.65,24.49 20.05,23.09 U15.5
NTC: length 40.7
  Top Layer w0.152: v1(10.06,7.35) 10.07,7.34 R99.1 ; v1(5.61,29.32) 5.61,27.68 R100.2 5.6,26.03 C100.2 v1(6.75,26.02) ; v1(12.47,25.13) 12.47,27.39 U18.12
  Bottom Layer w0.152: v1(12.47,25.13) 7.14,25.13 6.75,25.51 v1(6.75,26.02) ; v1(10.06,7.35) 9.17,7.35 4.72,11.79 4.72,28.94 5.1,29.32 v1(5.61,29.32)
O_IN: length 7.1
  Top Layer w0.152: X2.1 8.61,28.36 9.43,27.54 9.78,27.54 9.93,27.69 9.93,27.92 9.61,28.24 9.61,29 9.93,29.32 9.93,29.67 11.12,30.86 11.4,30.86 11.5,30.96 U18.5
O_OUT: length 7.1
  Top Layer w0.152: U18.6 11.5,30.46 11.4,30.55 11.25,30.55 10.23,29.54 10.23,27.41 9.8,26.98 9.64,26.98 8.62,25.96 X2.3
RGB: length 28.1
  Top Layer w0.152: U18.40 17.9,35.42 18.4,35.92 18.4,37.83 18.52,37.95 v2(19.03,37.95) ; v2(31.78,44.94) 34.08,44.94 RGB.1
  Bottom Layer w0.152: v2(31.78,44.94) 31.78,37.24 30.97,36.43 20.56,36.43 20.2,36.79 20.04,36.79 19.73,37.1 19.73,37.26 v2(19.03,37.95)
SCK: length 11.9
  Top Layer w0.152: v1(13.95,28.2) 13.9,28.15 U18.13
  Bottom Layer w0.152: v1(13.95,28.2) 13.97,28.17 17.76,28.17 19.67,26.27 19.67,25.89 19.92,25.64 U15.7
SWCLK: length 20
  Top Layer w0.152: v2(20.71,34.93) 20.71,35.43 20.31,35.83 19.28,35.83 19,35.54 19,35.29 18.9,35.19 U18.38 ; v1(8.45,32.57) 8.42,32.55 8.09,32.55 7.33,33.31 7.2,33.31
  Bottom Layer w0.152: v1(8.45,32.57) 9.05,32.57 9.33,32.29 18.29,32.29 18.92,32.92 18.92,33.07 18.55,33.44 18.55,33.59 19.48,34.52 19.63,34.52 20,34.15 20.15,34.15 20.23,34.23 20.23,34.46 v2(20.71,34.93)
SWDIO: length 20
  Top Layer w0.152: U18.37 19.4,35.19 19.3,35.29 19.3,35.41 19.41,35.52 19.85,35.52 20.02,35.35 20.02,34.47 20.22,34.27 21.32,34.27 v2(21.34,34.3) ; CN1.4 7.5,31.7 v1(8.62,31.7)
  Bottom Layer w0.152: v1(8.62,31.7) 9.02,31.7 9.31,31.98 18.42,31.98 20.38,33.95 20.99,33.95 v2(21.34,34.3)
UART1_RX: length 17.4
  Top Layer w0.152: CN1.6 6.37,30.21 9.01,30.21 v1(9.02,30.2) ; v1(15.81,33.23) 15.9,33.31 U18.44
  Bottom Layer w0.152: v1(9.02,30.2) 7.88,30.2 7.51,30.57 7.51,33.36 7.79,33.64 15.41,33.64 v1(15.81,33.23)
UART1_TX: length 17.4
  Top Layer w0.152: U18.43 16.4,33.14 v1(16.53,33) ; 6.42,31.46 6.45,31.46 6.93,30.99 v1(8.86,30.99)
  Bottom Layer w0.152: v1(16.53,33) 16.28,32.75 14.66,32.75 14.55,32.86 14.55,33.06 14.45,33.17 13.14,33.17 13.03,33.06 13.03,32.86 12.92,32.75 11.61,32.75 11.51,32.86 11.51,33.12 11.4,33.23 10.09,33.23 9.98,33.12 9.98,32.86 9.88,32.75 9.42,32.75 9.03,33.14 7.97,33.14 7.82,32.98 7.82,31.18 8.01,30.99 v1(8.86,30.99)
USB_DM: length 12.9
  Top Layer w0.152: v1(22.23,31.82) 22.03,31.82 21.67,31.46 U18.33 ; v1(25.18,34.72) 26,34.72 26.19,34.91 26.19,35.99 26.37,36.17 R78.1
  Inner2 w0.152: v1(25.18,34.72) 24.97,34.72 24.75,34.94 23.69,34.94 23.41,34.66 23.41,34.32 23.51,34.21 24.57,34.21 24.67,34.1 24.67,32.79 24.57,32.69 23.51,32.69 23.41,32.58 23.41,32 23.23,31.82 v1(22.23,31.82)
USB_DM_IN: length 23.6
  Top Layer w0.152: v1(40.74,25.51) 41.35,25.51 41.37,25.48 41.77,25.48 41.8,25.51 43.13,25.51 41.96,25.51 41.83,25.38 41.83,24.62 41.94,24.51 43.14,24.51 ; v1(30.25,29.44) 27.29,29.44 27.1,29.63 D8.4
  Inner1 w0.152: v1(30.25,29.44) 30.25,29.04 30.52,28.77 30.52,27.9 31.09,27.33 40.25,27.33 40.74,26.84 v1(40.74,25.51)
USB_DP: length 12.9
  Top Layer w0.152: U18.34 21.67,31.96 22.19,32.48 v1(22.26,32.48) ; R77.1 28.94,36.88 28.78,37.03 26.15,37.03 25.89,36.77 25.89,35.63 25.74,35.48 v1(25.18,35.48)
  Inner2 w0.152: v1(25.18,35.48) 24.97,35.48 24.75,35.25 23.56,35.25 23.1,34.78 23.1,32.59 22.99,32.48 v1(22.26,32.48)
USB_DP_IN: length 23.6
  Top Layer w0.152: D8.6 30.16,30.45 v1(31.1,29.52) ; v1(41.57,25.97) 41.61,26 USB.B6 44.34,26 44.45,25.89 44.45,25.13 44.32,25 43.14,25 USB.A6
  Inner1 w0.152: v1(31.1,29.52) 31.1,29.11 30.83,28.84 30.83,28.02 31.2,27.64 32.18,27.64 32.29,27.75 32.29,27.95 32.4,28.06 32.94,28.06 33.05,27.95 33.05,27.75 33.16,27.64 33.71,27.64 33.81,27.75 33.81,27.95 33.92,28.06 34.47,28.06 34.58,27.95 34.58,27.75 34.68,27.64 35.23,27.64 35.34,27.75 35.34,27.95 35.45,28.06 35.99,28.05 36.1,27.95 36.1,27.75 36.21,27.64 36.75,27.64 36.86,27.75 36.86,27.86 36.97,27.97 37.52,27.97 37.62,27.86 37.62,27.75 37.73,27.64 41.12,27.64 41.57,27.18 v1(41.57,25.97)
VB1: length 6.8
  Top Layer w0.152: 30.96,23.35 30.96,23.97 31.13,24.15 31.69,24.15 31.73,24.11 34.4,24.11 34.75,23.76 D3.1 34.75,22.84 35.3,22.29 C69.1
VB2: length 6.1
  Top Layer w0.152: 32.11,22.19 33.78,22.19 34.02,21.95 34.02,21.09 34.75,20.36 D4.1 34.75,19.41 34.89,19.27 35.16,19.27 35.33,19.11 35.33,18.52
VB3: length 7.6
  Top Layer w0.152: C71.1 35.17,15.82 34.75,16.24 D5.1 34.75,17.28 34.53,17.51 33.64,17.51 33,18.14 33,20.43 32.74,20.69 32.11,20.69
VUSB: length 10.7
  Top Layer w0.305: 43.35,23 43.37,22.98 44.29,22.98 44.34,23.03 45,23.03 45.45,23.48 45.45,27.29 45.23,27.5 44.93,27.5 44.9,27.47 44.34,27.47 44.31,27.5 43.35,27.5 ; USB.A4 42.14,22.7 41.38,21.95 41.03,21.95
$1N5464: length 4.5
  Top Layer w0.152: R74.1 38.59,35.01 R73.2 36.33,35.01 35.13,33.81 U6.3
$1N5465: length 5.4
  Top Layer w0.152: L1.1 40.25,31.08 39.97,31.37 C62.2 38.48,31.37 38.34,31.22 38.34,30.72 38.08,30.46 37.13,30.46 37.13,30.46
$1N5466: length 2.7
  Top Layer w0.152: 39.61,32.87 38.46,32.87 38.08,33.26 U6.1
$1N5543: length 9.6
  Top Layer w0.152: R54.2 10.27,15.47 10.4,15.35 10.4,14.84 10.65,14.59 12.43,14.59 12.68,14.84 12.68,15.47 R63.2 12.67,18.28 12.55,18.4 11.18,18.4 U14.6
$1N5544: length 4
  Top Layer w0.152: U14.5 11.14,19.03 9.89,19.03 9.63,18.78 R66.2 R55.2
$1N5545: length 8.9
  Top Layer w0.152: R63.1 11.17,17.7 U14.7 9.81,17.72 v1(9.76,17.76) ; v1(6.1,17.89) 5.44,17.89 5.26,17.7 R69.1
  Bottom Layer w0.152: v1(9.76,17.76) 9.63,17.89 v1(6.1,17.89)
$1N5549: length 9.7
  Top Layer w0.152: U14.9 16.65,18.27 15.22,18.27 15.11,18.16 15.11,15.49 R64.2 15.09,15.47 15.09,14.84 15.35,14.59 18.65,14.59 18.99,14.93 R56.2
$1N5552: length 18.3
  Top Layer w0.152: 16.75,17.12 16.75,16.75 16.57,16.57 16.57,15.56 16.61,15.52 R64.1 ; 16.75,17.12 16.74,17.13 v1(15.65,17.13) ; 16.75,17.12 U14.8 ; R70.1 v1(6.08,20.43)
  Bottom Layer w0.152: v1(6.08,20.43) 6.08,19.28 5.57,18.78 5.57,17.02 5.95,16.64 15.12,16.64 15.6,17.13
$1N5554: length 7
  Top Layer w0.152: R72.2 18.99,21.91 18.02,20.94 16.78,20.94 U14.13 16.72,20.94 15.6,20.94 15.1,21.44 15.1,23.73
$1N5555: length 13.8
  Top Layer w0.152: U14.12 18.03,20.32 18.14,20.43 R68.2 19.03,20.47 v1(19.03,21.19) ; R59.2 18.99,24.24 19.25,24.49 21.19,24.49 21.83,23.86 21.83,22.59 22.56,21.85 v1(22.56,21.44)
  Bottom Layer w0.152: 19.16,21.19 19.26,21.09 19.26,20.97 19.57,20.66 22.18,20.66 22.56,21.04 v1(22.56,21.44)
$1N5557: length 14.9
  Top Layer w0.152: U14.14 16.75,21.62 16.75,22.21 16.6,22.35 16.6,23.06 16.61,23.07 16.61,23.73 16.62,23.74 16.62,24.36 16.49,24.49 5.44,24.49 5.26,24.31 R71.1
$1N5599: length 1.8
  Top Layer w0.152: R89.1 45.2,33.5 LED.2
$1N5608: length 13.2
  Top Layer w0.152: R82.2 24.72,14.69 24.37,14.33 19.28,14.33 18.9,13.95 18.9,9.37 18.77,9.25 18.49,9.25 18.27,9.02 18.27,8.51 Q4.4
$1N5612: length 13.4
  Top Layer w0.152: Q2.4 24.49,3.89 25,4.4 25,7.83 25.16,7.99 25.79,7.99 26.01,8.21 26.01,14.83 26.47,15.3 R83.2
$1N5614: length 10.5
  Top Layer w0.152: Q5.4 25.88,7.65 26.27,8.03 26.27,14.2 26.65,14.59 27.92,14.59 28.18,14.84 28.18,15.81 R84.2
$1N5617: length 14.4
  Top Layer w0.152: Q3.4 32.08,5.29 32.4,5.61 32.4,9.16 32.62,9.37 32.98,9.37 33.12,9.51 33.12,14.11 32.78,14.45 30.21,14.45 29.95,14.71 29.95,15.84 R85.2
$1N5619: length 8.8
  Top Layer w0.152: R86.2 31.73,14.87 31.88,14.71 33.13,14.71 33.38,14.46 33.38,8.55 Q6.4
$1N5625: length 5.4
  Top Layer w0.152: U14.3 11.14,20.3 10.01,20.3 9.76,20.56 9.76,21.83 9.51,22.08 R61.2 8.87,22.08 R60.1
$1N5641: length 15.9
  Top Layer w0.152: R81.2 22.97,14.97 22.59,14.59 19.03,14.59 18.65,14.2 18.65,9.74 18.42,9.51 18.4,9.51 18.27,9.38 17.66,9.38 17.34,9.06 17.34,5.53 17.1,5.29 Q1.4
$1N5644: length 4.2
  Top Layer w0.152: U14.2 11.18,20.94 12.43,20.94 12.67,21.18 R62.1
$1N9644: length 2.8
  Top Layer w0.152: 40.36,26.91 41.64,26.91 41.76,27.03 43.11,27.03 USB.B5
$1N9655: length 3
  Top Layer w0.152: 43.35,24 43.33,23.98 40.41,23.98
$1N10412: length 1.9
  Top Layer w0.152: D8.1 29,33.83 28.94,33.89 28.94,34.66
$1N10416: length 1.9
  Top Layer w0.152: 27.16,34.66 27.16,33.89 27.1,33.83 D8.3
$1N15779: length 4
  Top Layer w0.152: U14.10 17.44,19.02 17.56,18.9 17.9,18.9 18.02,18.78 R67.2 R57.2
$1N40669: length 2.1
  Top Layer w0.152: 35.23,30.46 35.22,30.46 34.27,30.46 34.02,30.72 33.25,30.72

## Copper pours and planes (outline as drawn; the poured copper is in the pictures)
+3.3V on Inner1: 8.87,38.46 7.98,38.46 7.98,29.83 13.82,23.98 38.84,23.98 40.75,25.89 40.75,41.13 37.57,44.3 14.71,44.3
+5V on Inner2: 43.03,7.22 43.03,26.35 42.88,26.5 41.4,26.5 40.75,27.16 40.75,37.83 40.62,37.95 40.62,38.46 32.62,46.46 16.95,46.46 13.95,43.47 13.95,20.17 11.89,18.11 -1.54,18.11 -1.54,19.92 -2.18,20.56 -2.18,42.14 7.73,52.05 45.57,52.05 52.18,45.45 52.18,11.41 47.99,7.22
+12V on Top Layer: 28.94,10.9 32.75,10.9 32.75,5.95 28.94,5.95
+12V on Top Layer: 14.21,10.9 18.27,10.9 18.27,5.95 14.21,5.95
+12V on Top Layer: 21.7,9.51 25.64,9.51 25.64,4.55 21.7,4.55
+12V on Top Layer: 27.79,43.92 34.26,43.92 34.26,33.8 27.79,33.8
+12V on Bottom Layer: 14.21,10.9 18.27,10.9 18.27,5.95 14.21,5.95
+12V on Bottom Layer: 21.7,9.51 25.64,9.51 25.64,4.55 21.7,4.55
+12V on Bottom Layer: 28.94,10.9 32.75,10.9 32.75,5.95 28.94,5.95
+12V on Inner1: 21.7,9.51 25.64,9.51 25.64,4.55 21.7,4.55
+12V on Inner1: 28.94,10.9 32.75,10.9 32.75,5.95 28.94,5.95
+12V on Inner1: 14.21,10.9 18.27,10.9 18.27,5.95 14.21,5.95
+12V on Inner2: 40.24,38.33 32.37,46.21 17.29,46.21 14.75,43.67 14.75,20.34 11.79,17.38 0.62,17.38 -0.15,16.62 -0.15,8.62 9.25,-0.78 37.06,-0.78 42.78,4.93 42.78,25.76 40.24,25.76
GND on Top Layer: 10.28,50.15 -2.05,37.95 -2.05,23.73 -0.65,22.33 22.77,22.33 22.77,14.91 24.11,13.57 49.38,13.57 53.45,17.63 53.45,39.22 42.53,50.15
GND on Bottom Layer: -7.77,50.78 59.8,50.78 59.8,14.2 -7.77,14.2
GND on Inner1: -4.08,50.65 52.31,50.65 52.31,14.71 -4.08,14.71
PGND on Top Layer: 22.33,43.92 32.39,43.92 32.39,33.76 22.33,33.76
PGND on Top Layer: 14.46,14.08 18.27,14.08 18.27,12.17 14.46,12.17
PGND on Top Layer: 28.94,13.95 32.75,13.95 32.75,12.05 28.94,12.05
PGND on Top Layer: 21.7,12.55 25.64,12.55 25.64,10.65 21.7,10.65
PGND on Inner2: 23.35,43.16 22.46,42.27 22.46,38.72 24.37,36.81 28.05,36.81 28.05,16.81 27.79,16.56 18.25,16.56 16.15,14.46 16.15,11.24 16.75,10.65 35.67,10.65 37.19,12.17 37.19,25.6 35.34,27.45 32.78,27.45 32.75,27.41 31.48,28.68 31.48,38.51 30.77,39.22 27.41,39.22 27.41,42.02 26.27,43.16
IA+ on Top Layer: 18.65,10.39 21.19,10.39 21.19,8.11 18.65,8.11
IB+ on Top Layer: 26.27,9.12 28.3,9.12 28.3,6.59 26.27,6.59
IC+ on Top Layer: 33.76,10.39 35.54,10.39 35.54,7.98 33.76,7.98
MA on Top Layer: 14.21,7.86 20.68,7.86 20.68,1.76 14.21,1.76
MA on Bottom Layer: 14.21,7.86 20.68,7.86 20.68,1.76 14.21,1.76
MA on Inner1: 14.21,7.86 20.68,7.86 20.68,1.76 14.21,1.76
MA on Inner2: 14.21,7.86 20.68,7.86 20.68,1.76 14.21,1.76
MB on Top Layer: 21.83,6.3 28.45,6.3 28.45,0.36 21.83,0.36
MB on Bottom Layer: 21.83,6.3 28.45,6.3 28.45,0.36 21.83,0.36
MB on Inner1: 21.83,6.3 28.45,6.3 28.45,0.36 21.83,0.36
MB on Inner2: 21.83,6.3 28.45,6.3 28.45,0.36 21.83,0.36
MC on Top Layer: 29.32,7.73 35.67,7.73 35.67,1.63 29.32,1.63
MC on Bottom Layer: 29.32,7.73 35.67,7.73 35.67,1.63 29.32,1.63
MC on Inner1: 29.32,7.73 35.67,7.73 35.67,1.63 29.32,1.63
MC on Inner2: 29.32,7.73 35.67,7.73 35.67,1.63 29.32,1.63

Small or netless copper shapes (teardrops, artwork), in the pictures only: 337 on Top Layer, 50 on Bottom Layer, 24 on Inner1, 6 on Inner2

## Text on the board
Bottom Silkscreen Layer: RX | TX | DIO | CLK | 5V | GND | H | L | VBUS
Top Silkscreen Layer: A | B | C | SWD | JLCJLCJLCJLC | G | V
